# EAGLE design smoggie (EAGLE 8.3.1)
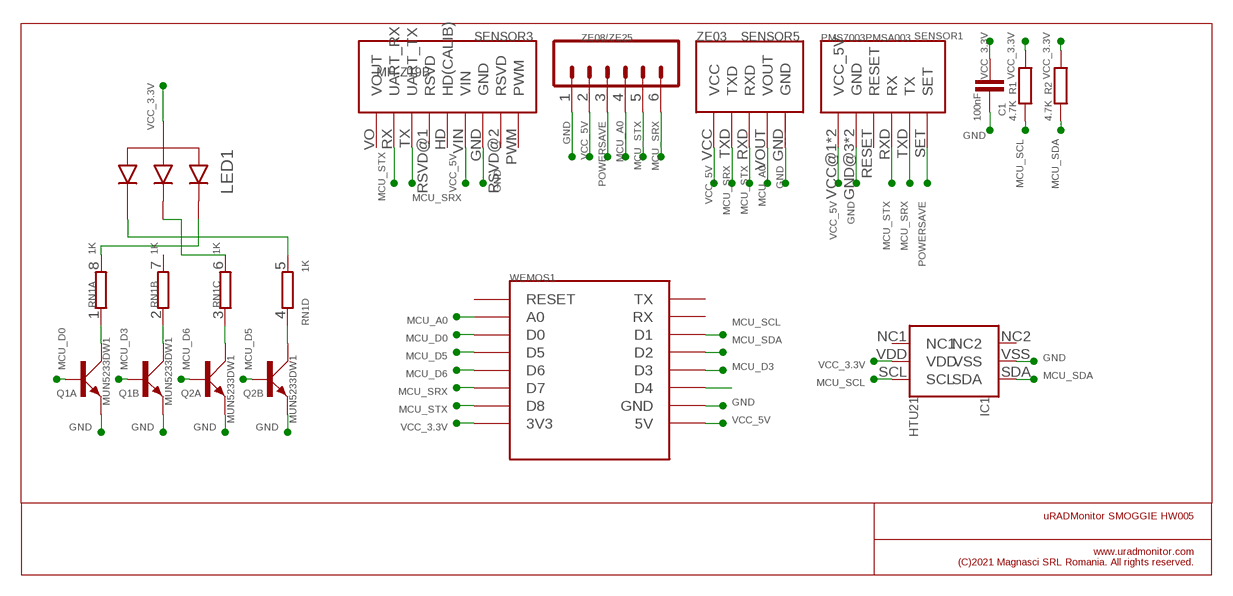
[diagram p0: schematic, sheet 1]

## Parts
C1  100nF  C-EUC0603  [C0603]
IC1  HTU21  SHT21SMDSMD  [SHT21]
LED1  LED_1615_RGB_CA  [1615_LED_CA]
Q1  MUN5233DW1  BC847BS  [SOT363_PHILIPS]
Q2  MUN5233DW1  BC847BS  [SOT363_PHILIPS]
R1  4.7K  R-EU_R0603  [R0603]
R2  4.7K  R-EU_R0603  [R0603]
RN1  1K  4R-N0603-ARC  [0603-ARC]
SENSOR1  PMS7003PMSA003  [PMSA003]
SENSOR3  MH-Z19B  [MH-Z19B]
SENSOR5  ZE03  [ZE03]
WEMOS1  11  WEMOS-D1-MINI  [WEMOS-D1-MINI]
ZE08/ZE25  M06SIP  [1X06]

## Nets
GND: C1.1 IC1.VSS Q1.1(A:E) Q1.4(B:E) Q2.1(A:E) Q2.4(B:E) SENSOR1.GND@3(GND) SENSOR1.GND@4(GND) SENSOR3.GND SENSOR5.GND WEMOS1.GND ZE08/ZE25.1
MCU_A0: SENSOR5.VOUT WEMOS1.A0 ZE08/ZE25.4
MCU_D0: Q1.2(A:B) WEMOS1.D0
MCU_D3: Q1.5(B:B) WEMOS1.D3
MCU_D5: Q2.5(B:B) WEMOS1.D5
MCU_D6: Q2.2(A:B) WEMOS1.D6
MCU_SCL: IC1.SCL R1.2 WEMOS1.D1
MCU_SDA: IC1.SDA R2.2 WEMOS1.D2
MCU_SRX: SENSOR1.TXD(TX) SENSOR3.TX(UART_TX) SENSOR5.TXD WEMOS1.D7 ZE08/ZE25.6
MCU_STX: SENSOR1.RXD(RX) SENSOR3.RX(UART_RX) SENSOR5.RXD WEMOS1.D8 ZE08/ZE25.5
N$1: LED1.P$4(P4_BLUE) RN1.8
N$2: LED1.P$3(P3_GREEN) RN1.6
N$3: Q1.6(A:C) RN1.1
N$4: Q1.3(B:C) RN1.2
N$5: Q2.6(A:C) RN1.3
N$6: Q2.3(B:C) RN1.4
N$7: WEMOS1.D4
N$8: LED1.P$2(P2_RED) RN1.5
POWERSAVE: SENSOR1.SET ZE08/ZE25.3
VCC_3.3V: C1.2 IC1.VDD LED1.P$1(P1_CA) R1.1 R2.1 WEMOS1.3V3
VCC_5V: SENSOR1.VCC@1(VCC_5V) SENSOR1.VCC@2(VCC_5V) SENSOR3.VIN SENSOR5.VCC WEMOS1.5V ZE08/ZE25.2
Unconnected: IC1.NC1 IC1.NC2 RN1.7 SENSOR1.RESET SENSOR3.HD(HD(CALIB)) SENSOR3.PWM SENSOR3.RSVD@1(RSVD) SENSOR3.RSVD@2(RSVD) SENSOR3.VO(VOUT) WEMOS1.RESET WEMOS1.RX WEMOS1.TX

## Notes on the sheet
- uRADMonitor SMOGGIE HW005
- www.uradmonitor.com
  (C)2021 Magnasci SRL Romania. All rights reserved.

## Library data of the parts
C1 = rcl:C-EU: CAPACITOR, European symbol
IC1 = sensirion-sht-sensors:SHT21: SHT 21 (Senzor) EN: Type: Humidity and Temperature Senzor ± 2% Case: DFN6 Interface: I2C Manufacturer: SENSIRION CZ: Typ: Senzor Teploty a Vlhkosti ± 2% Pouzdro: DFN6 Rozhraní: I2C Výrobce: SENSIRION Datasheet: https://html.alldatasheet.com/html-pdf/347386/SENSITRON/SHT21/484/1/SHT21.html Created by: GreyhoundPCBDesign
LED1 = uradmonitor:LED_1615_RGB_CA
Q1 Q2 = transistor-small-signal:BC847BS: NPN general purpose double transistor Source: http://www.farnell.com/datasheets/2466.pdf
R1 R2 = resistor:R-EU_: RESISTOR, European symbol
RN1 = resistor-dil:4R-N: Array Chip Resistor Source: RS Component / Phycomp; OC_FARNELL: unknown; OC_NEWARK: unknown
SENSOR1 = uradmonitor:PMS7003: Plantower PMS-7003 Air Quality Sensor for PM0.3, PM0.5, PM1.0, PM2.5, PM5.0, PM10.0 Key Features ◆ laser scattering principle to achieve accurate measurement ◆ zero error alarm rate ◆ real-time response and support continuous acquisition ◆ minimum resolution particle size 0.3μ m ◆ new patent structure, six full range of shielding, anti-jamming performance stronger ◆ The direction of the inlet and outlet can be selected, the scope of application is wide and the user does not need to design the air duct again ◆ ultra-thin design, only 12 mm, suitable for portable devices Overview PMS7003 is a digital versatile particle concentration sensor based on the principle of laser scattering, continuous mining And calculate the number of suspended particles in different sizes of air in the unit volume, that is, the concentration distribution of particles, And converted into mass concentration, and in the form of general digital interface output. The sensor can be embedded in a variety of air Suspended particle concentration in the instrument or environmental improvement equipment, to provide timely and accurate concentration according to.
SENSOR3 = uradmonitor:MH-Z19B: Winsensor CO2 NDIR sensor
SENSOR5 = uradmonitor:ZE03: Winsensor ZE03 sensor for CO, NO2, SO2, O3, Cl2, H2S, NH3, etc
WEMOS1 = esp8266modules_2:WEMOS-D1-MINI: WeMos.cc D1 mini ESP8266 module
ZE08/ZE25 = sparkfun-connectors:M06: Header 6 Standard 6-pin 0.1" header. Use with straight break away headers (SKU : PRT-00116), right angle break away headers (PRT-00553), swiss pins (PRT-00743), machine pins (PRT-00117), and female headers (PRT-00115). Molex polarized connector foot print use with SKU : PRT-08094 with associated crimp pins and housings. NOTES ON THE VARIANTS LOCK and LOCK_LONGPADS... This footprint was designed to help hold the alignment of a through-hole component (i.e. 6-pin header) while soldering it into place. You may notice that each hole has been shifted either up or down by 0.005 of an inch from it's more standard position (which is a perfectly straight line). This slight alteration caused the pins (the squares in the middle) to touch the edges of the holes. Because they are alternating, it causes a "brace" to hold the component in place. 0.005 has proven to be the perfect amount of "off-center" position when using our standard breakaway headers. Although looks a little odd when you look at the bare footprint, once you have a header in there, the alteration is very hard to notice. Also,if you push a header all the way into place, it is covered up entirely on the bottom side. This idea of altering the position of holes to aid alignment will be further integrated into the Sparkfun Library for other footprints. It can help hold any component with 3 or more connection pins.

## Board
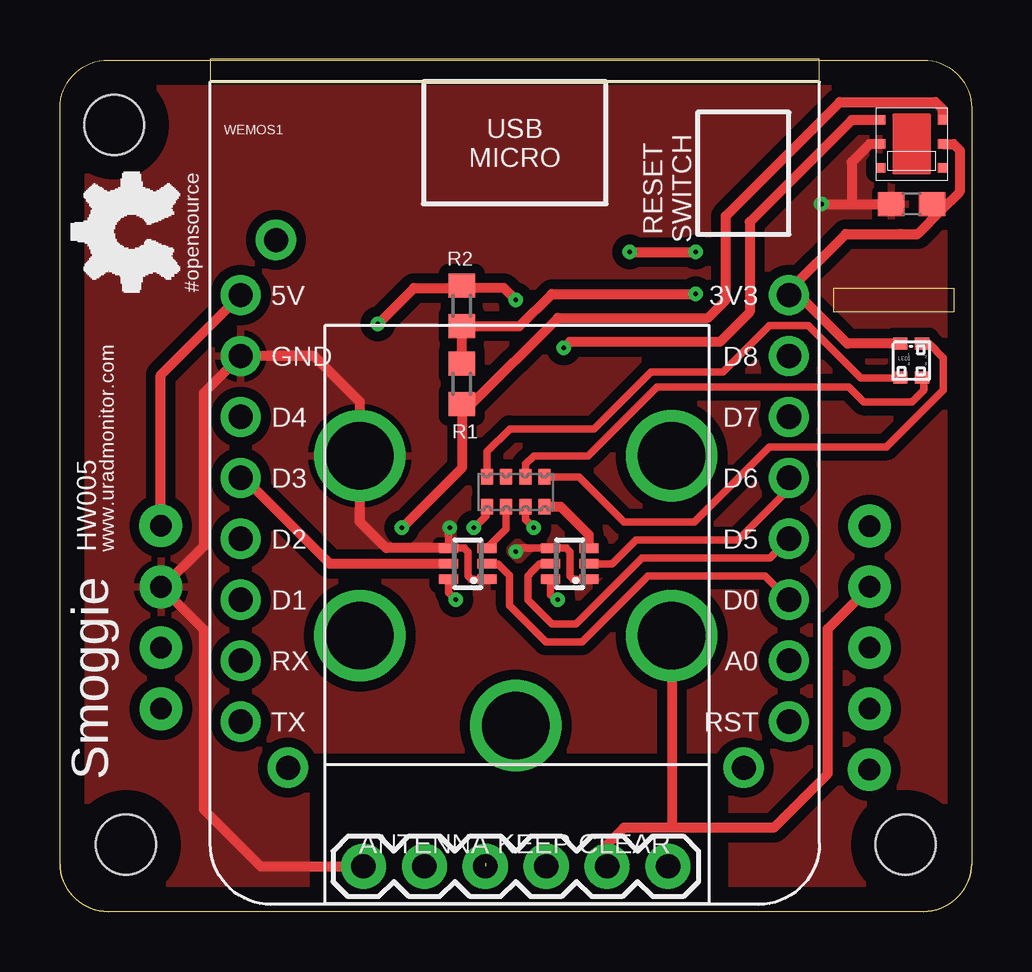
[diagram p1: board, top side]
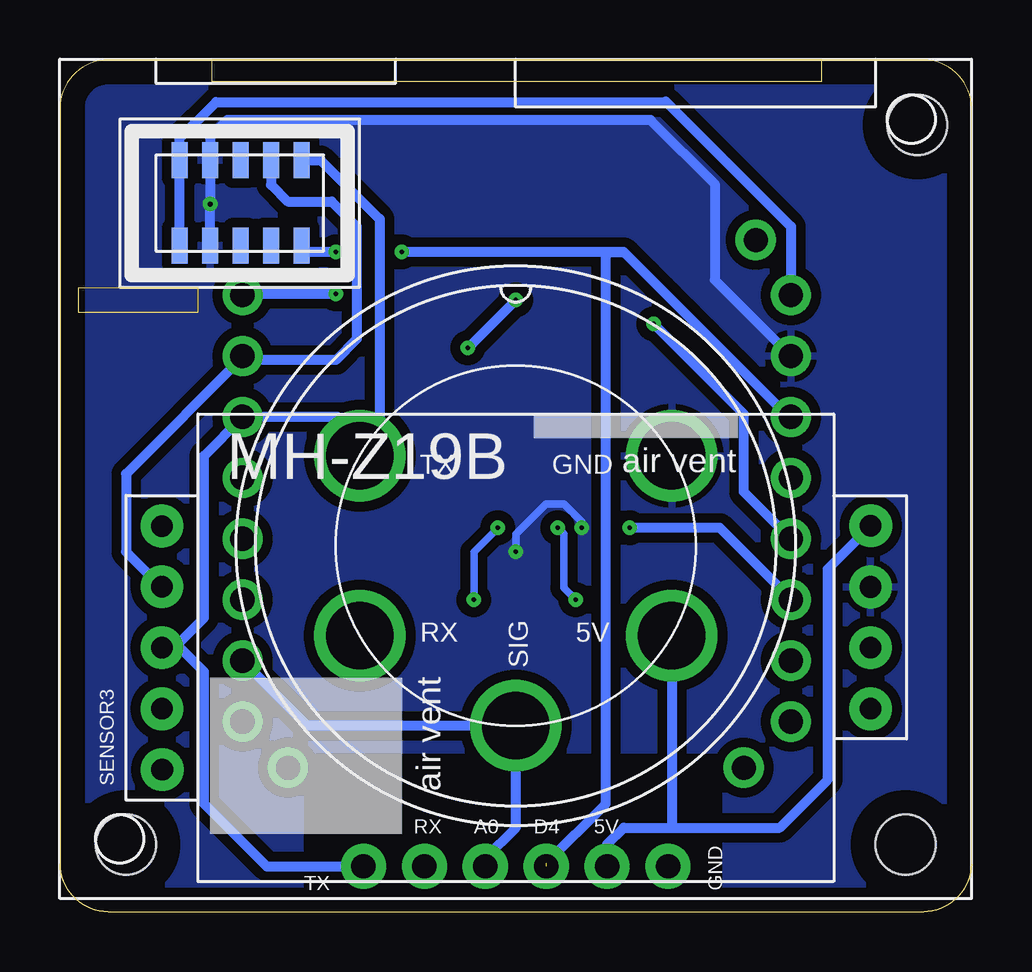
[diagram p2: board, bottom side, seen from below]

Size 38 x 35.5 mm. Coordinates in mm from the lower left corner, seen from the top.
Outline: 2,35.5 36,35.5 arc-90 38,33.5 38,2 arc-90 36,0 2,0 arc-90 0,2 0,33.5 arc-90 2,35.5
Copper layers (1*16): Top 0.035mm / dielectric 1.5mm / Bottom 0.035mm
Design rules "default": minimum track width 10mil, minimum drill 24mil, track to track 8mil, track to pad 8mil, pad to pad 8mil, via to via 8mil, smd to smd 8mil, copper to edge 40mil, drill to drill 8mil, minimum pad ring 10mil, minimum via ring 8mil, stop-mask expansion 4mil, vias tented up to drill 0mil, thermal gap 10mil
Holes 2.5 mm at 2.26,32.79 35.26,2.79 2.76,2.79
Milling: 11 lines

### Footprints (pad centres in the part's own frame; a part is rotated, then mirrored left to right if it is on the bottom)
C0603 = smd 1.1 x 1: 1 -0.85,0; 2 0.85,0
SHT21 = smd 0.4 x 0.4: NC1 0.5,0.2; NC2 0.5,2.8; SCL 2.5,0.2; SDA 2.5,2.8; VDD 1.5,0.2; VSS 1.5,2.8
1615_LED_CA = smd 0.6 x 0.5: P$1 -0.97,1.17; P$2 -0.07,1.17; P$3 -0.07,-0.23; P$4 -0.97,-0.23
SOT363_PHILIPS = smd 0.4 x 0.8: 1 -0.65,-0.8; 2 0,-0.8; 3 0.65,-0.8; 4 0.65,0.8; 5 0,0.8; 6 -0.65,0.8
R0603 = smd 1 x 1.1: 1 -0.85,0; 2 0.85,0
0603-ARC = smd 0.5 x 0.65: 1 -1.2,-0.625; 2 -0.4,-0.625; 3 0.4,-0.625; 4 1.2,-0.625; 5 1.2,0.625; 6 0.4,0.625; 7 -0.4,0.625; 8 -1.2,0.625
PMSA003 = smd 0.66 x 1.5: GND@3 6.27,-4.215; GND@4 6.27,-7.79; NC1 7.54,-7.79; NC2 8.81,-7.79; RESET 7.54,-4.215; RXD 8.81,-4.215; SET 10.08,-7.79; TXD 10.08,-4.215; VCC@1 5,-4.215; VCC@2 5,-7.79
MH-Z19B = drill 0.9 pad 1.778: GND -10.04,-6.28; HD 19.49,1.34; PWM -10.04,-1.2; RSVD@1 19.5,-1.2; RSVD@2 -10.04,-3.75; RX 19.5,-6.29; TX 19.5,-3.75; VIN -10.05,-8.83; VO 19.5,-8.82
ZE03 = drill 2.8: GND 6.5,3.75; RXD -6.5,-3.75; TXD -6.5,3.75; VCC 6.5,-3.75; VOUT 0,-7.5
WEMOS-D1-MINI = drill 1.016 pad 1.676: 3V3 -10.16,-10.16; 5V 12.7,-10.16; A0 -10.16,5.08; D0 -10.16,2.54; D1 12.7,2.54; D2 12.7,0; D3 12.7,-2.54; D4 12.7,-5.08; D5 -10.16,0; D6 -10.16,-2.54; D7 -10.16,-5.08; D8 -10.16,-7.62; GND 12.7,-7.62; RESET -10.16,7.62; RX 12.7,5.08; TX 12.7,7.62
1X06 = drill 1.016 pad 1.88: 1 0,0; 2 2.54,0; 3 5.08,0; 4 7.62,0; 5 10.16,0; 6 12.7,0

### Placement (x,y rotation side)
C1  35.5,29.5 0 top
IC1  37,30.5 90 top
LED1  36,22.5 0 top
Q1  17,14.5 90 top
Q2  21.25,14.5 90 top
R1  16.75,22 270 top
R2  16.75,25.25 90 top
RN1  19,17.5 0 top
SENSOR1  38.01,35.54 0 bottom
SENSOR3  14.25,7.25 180 bottom
SENSOR5  19,15.25 0 bottom
WEMOS1  20.23,15.54 180 top
ZE08/ZE25  12.65,1.88 0 top

### Tracks (layer width: path | path; a pad name or v marks a point on that pad's centre or on a via)
GND  (via drill 0.2)
  Top 0.305: Q1.1 17.15,13.85 17,14 17,15 16.85,15.15 Q1.4 16.2,15.95 v16.25,16 | Q2.1 21.4,13.85 21.25,14 21.25,15 21.1,15.15 Q2.4 19.1,15.15 v19,15
  Top 0.406: ZE08/ZE25.1 8.36,1.88 6,4.25 6,11.74 SENSOR3.GND 4.28,13.53 6,15.25 6,21.63 WEMOS1.GND 10.59,23.16 12.5,21.25 SENSOR5.GND 12.5,16.25 13.6,15.15 Q1.4 | 33,29.5 C1.1 | IC1.VSS 33.75,32 33,31.25 33,29.5 | v31.74,29.49 32.99,29.49 33,29.5
  Bottom 0.305: 31.74,32.28 31.72,32.28 31,33 | v16.25,16 16.25,16.25 17,17 17.75,17 19,15.75 v19,15
  Bottom 0.406: SENSOR1.GND@4 v31.74,29.49 SENSOR1.GND@3 31.74,32.28 31.03,33 31,33 13.38,33 10.7,30.33 10.7,26.33 WEMOS1.GND
  pour Top (isolate 0.406): 2,35.5 arc90 0,33.5 0,2 arc90 2,0 10.25,0 10.25,6.75 28,6.75 28,0 36,0 arc90 38,2 38,33.5 arc90 36,35.5
  pour Bottom (isolate 0.406): 2,35.5 36,35.5 arc-90 38,33.5 38,2 arc-90 36,0 28,0 28,6.75 10.25,6.75 10.25,0 2,0 arc-90 0,2 0,33.5 arc-90
MCU_A0
  Bottom 0.406: WEMOS1.A0 27.68,7.75 19.11,7.75 | 19.11,7.75 SENSOR5.VOUT | ZE08/ZE25.4 20.27,2.23 19,3.5 19,7.64 19.11,7.75
MCU_D0
  Top 0.305: Q1.2 18.25,14.5 18.56,14.2 18.56,14.19 18.74,14.01 18.74,12.76 20.25,11.25 21.75,11.25 24.5,14 29.39,14 WEMOS1.D0
MCU_D3
  Top 0.406: WEMOS1.D3 7.67,18.08 11.25,14.5 Q1.5
MCU_D5
  Top 0.305: Q2.5 20,14.5 19.69,14.2 19.69,14.19 19.5,14 19.5,13 20.5,12 21.5,12 24.25,14.75 29.6,14.75 WEMOS1.D5
MCU_D6
  Top 0.305: Q2.2 23,14.5 24,15.5 28.25,15.5 30.25,17.5 30.25,17.94 WEMOS1.D6
MCU_SCL  (via drill 0.2)
  Top 0.406: IC1.SCL 36.8,33.45 36.5,33.75 32.5,33.75 27.75,29 27.75,25.5 27,24.75 20.75,24.75 17.15,21.15 R1.2 16.75,18.5 v14.25,16
  Bottom 0.406: WEMOS1.D1 7.53,13.03 10.5,16 v14.25,16
MCU_SDA  (via drill 0.2)
  Top 0.406: v13.25,24.5 14.75,26 16.65,26 R2.2 16.85,26 18.5,26 v19,25.5 | IC1.SDA 33,33 28.75,28.75 28.75,25 27.5,23.75 21.25,23.75 v21,23.5
  Bottom 0.406: WEMOS1.D2 9.5,17.5 9.5,20.75 v13.25,24.5 | v21,23.5 v19,25.5
MCU_SRX
  Bottom 0.305: 33.25,11 33.12,11.12 | WEMOS1.D7
  Bottom 0.406: SENSOR1.TXD 27.13,31.33 24.67,28.87 24.67,20.51 25.5,19.68 | WEMOS1.D7 26.44,20.62 25.5,19.68 | SENSOR3.TX 33.25,11 | WEMOS1.D7 32,19 32,12.25 33.12,11.12 32,10 32,4.5 29.39,1.88 ZE08/ZE25.6 | 25.5,19.68 SENSOR5.TXD
MCU_STX
  Top 0.305: SENSOR3.RX 33.71,13.54
  Top 0.406: 25.5,3.5 29.75,3.5 32,5.75 32,11.79 SENSOR3.RX | SENSOR5.RXD 25.5,3.5 | 25.5,3.5 23.5,3.5 22.75,2.75 22.75,1.95 ZE08/ZE25.5
  Bottom 0.406: SENSOR1.RXD 29.2,30.29 28.51,29.6 26.67,29.6 25.63,28.55 25.63,23.87 26.5,23 30.23,23 WEMOS1.D8 30.39,23.11 35.25,18.25 35.25,15 33.75,13.5 SENSOR3.RX
N$1
  Top 0.305: RN1.8 17.8,19.17 18.75,20.12 22.25,20.12 24.62,22.5 27.62,22.5 29.56,24.44 31.19,24.44 33.38,22.25 35.01,22.25 LED1.P$4
N$2
  Top 0.305: RN1.6 19.4,18.65 19.75,19 22,19 24.88,21.88 32.88,21.88 33.5,21.25 35.5,21.25 36,21.75 36,22.2 LED1.P$3
N$3  (via drill 0.2)
  Top 0.305: v17.25,16 17.75,16.5 17.75,16.83 RN1.1 | v16.5,13 16.2,13.3 Q1.6
  Bottom 0.305: v17.25,16 17,15.75 17,13.5 v16.5,13
N$4
  Top 0.305: RN1.2 18.6,15.95 Q1.3
N$5  (via drill 0.2)
  Top 0.305: Q2.6 20.45,13.2 v20.75,13 | v19.75,16 19.4,16.35 RN1.3
  Bottom 0.305: v20.75,13 20.75,15 v19.75,16
N$6
  Top 0.305: 22,15.2 Q2.3
  Top 0.406: RN1.4 20.88,16.88 22.05,15.7 Q2.3
N$8
  Top 0.305: RN1.5 21.62,18.12 23.5,16.25 26.44,16.25 29.56,19.38 34.46,19.38 36.83,21.75 36.83,23.08 36.24,23.67 LED1.P$2
POWERSAVE  (via drill 0.2 pad 0.2)  (1 unrouted)
  Top 0.406: v23.75,27.5 v26.5,27.5
  Bottom 0.406: 17.73,2.02 15.25,4.5 15.25,27.5 | v26.5,27.5 27.68,27.5 SENSOR1.SET | 14.5,27.5 7.62,20.62 | 14.5,27.5 v23.75,27.5 | 15.25,27.5 15.28,27.47 | 15.25,27.5 14.5,27.5
SOLDER1  (via drill 1 pad 1.68)
  other vias: 9,28
SOLDER2  (via drill 1 pad 1.68)
  other vias: 9.5,6
SOLDER3  (via drill 1 pad 1.68)
  other vias: 28.5,6
VCC_3.3V  (via drill 0.2)
  Top 0.406: IC1.VDD 37.25,32 37.5,31.75 37.5,30 36.72,29.22 | 36.72,29.22 35.75,28.25 35.03,28.25 32.75,28.25 30.39,25.89 WEMOS1.3V3 30.34,25.75 30.75,25.75 32.83,23.67 LED1.P$1 | C1.2 36.43,29.5 36.72,29.22 | R1.1 R2.1 19.15,24.4 20.5,25.75 v26.5,25.75
  Bottom 0.406: v26.5,25.75 30.34,25.75 WEMOS1.3V3
VCC_5V
  Top 0.406: SENSOR3.VIN 4.2,22.37 WEMOS1.5V
  Bottom 0.406: SENSOR1.VCC@2 SENSOR1.VCC@1 33.01,32.24 31.5,33.75 12.77,33.75 12.75,33.77 7.53,28.55 WEMOS1.5V 7.45,25.7 | ZE08/ZE25.2 15.19,2.81 14.5,3.5 12.5,3.5 | 12.5,3.5 8,3.5 6,5.5 6,14.28 SENSOR3.VIN | SENSOR5.VCC 12.5,3.5

### Text on the board
tNames: #opensource | HW005 | www.uradmonitor.com | Smoggie
bNames: 5V | D4 | A0 | RX | GND | TX